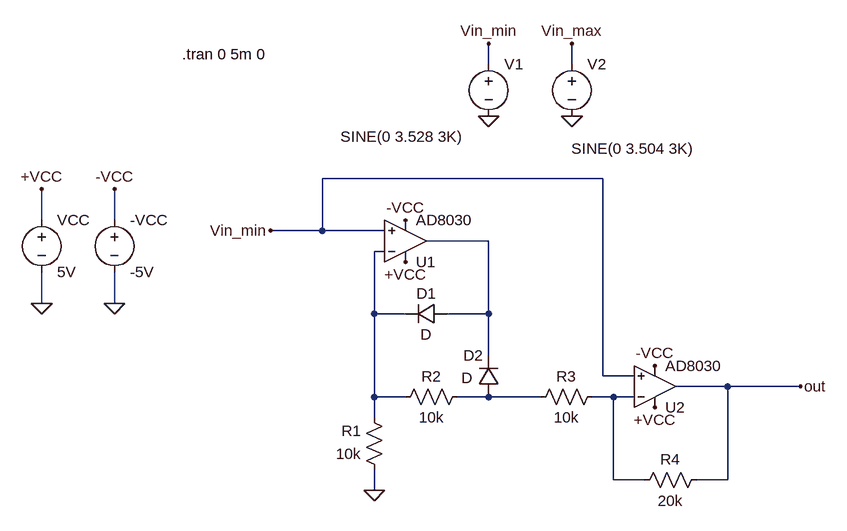
[diagram p0: schematic Trans.asc]
Trans.asc, the LTspice schematic file:
Version 4.1
SHEET 1 880 680
WIRE 144 -304 144 -336
WIRE 272 -304 272 -336
WIRE 320 -128 -112 -128
WIRE -544 -64 -544 -112
WIRE -432 -64 -432 -112
WIRE -112 -48 -112 -128
WIRE -112 -48 -192 -48
WIRE -16 -48 -112 -48
WIRE 144 -32 48 -32
WIRE -16 -16 -32 -16
WIRE -544 64 -544 16
WIRE -432 64 -432 16
WIRE -32 80 -32 -16
WIRE 16 80 -32 80
WIRE 144 80 144 -32
WIRE 144 80 80 80
WIRE 144 144 144 80
WIRE 320 176 320 -128
WIRE 368 176 320 176
WIRE 512 192 432 192
WIRE 624 192 512 192
WIRE -32 208 -32 80
WIRE 16 208 -32 208
WIRE 144 208 96 208
WIRE 224 208 144 208
WIRE 336 208 304 208
WIRE 368 208 336 208
WIRE -32 240 -32 208
WIRE 336 336 336 208
WIRE 384 336 336 336
WIRE 512 336 512 192
WIRE 512 336 464 336
WIRE -32 352 -32 320
FLAG -32 352 0
FLAG 624 192 out
FLAG -432 64 0
FLAG -544 64 0
FLAG -544 -112 +VCC
FLAG -432 -112 -VCC
FLAG 16 0 +VCC
FLAG 400 224 +VCC
FLAG 16 -64 -VCC
FLAG 400 160 -VCC
FLAG 272 -224 0
FLAG 144 -224 0
FLAG 144 -336 Vin_min
FLAG 272 -336 Vin_max
FLAG -192 -48 Vin_min
SYMBOL OpAmps\\AD8030 16 32 M180
SYMATTR InstName U1
SYMBOL OpAmps\\AD8030 400 256 M180
SYMATTR InstName U2
SYMBOL diode 80 64 R90
WINDOW 0 0 32 VBottom 2
WINDOW 3 32 32 VTop 2
SYMATTR InstName D1
SYMBOL diode 160 208 R180
WINDOW 0 24 64 Left 2
WINDOW 3 41 29 Left 2
SYMATTR InstName D2
SYMBOL res -16 336 R180
WINDOW 0 36 76 Left 2
WINDOW 3 36 40 Left 2
SYMATTR InstName R1
SYMATTR Value 10k
SYMBOL res 112 192 R90
WINDOW 0 0 56 VBottom 2
WINDOW 3 32 56 VTop 2
SYMATTR InstName R2
SYMATTR Value 10k
SYMBOL res 320 192 R90
WINDOW 0 0 56 VBottom 2
WINDOW 3 32 56 VTop 2
SYMATTR InstName R3
SYMATTR Value 10k
SYMBOL res 480 320 R90
WINDOW 0 0 56 VBottom 2
WINDOW 3 32 56 VTop 2
SYMATTR InstName R4
SYMATTR Value 20k
SYMBOL voltage -544 -80 R0
WINDOW 123 0 0 Left 0
WINDOW 39 0 0 Left 0
SYMATTR InstName VCC
SYMATTR Value 5V
SYMBOL voltage -432 -80 R0
WINDOW 123 0 0 Left 0
WINDOW 39 0 0 Left 0
SYMATTR InstName -VCC
SYMATTR Value -5V
SYMBOL voltage 144 -320 R0
WINDOW 3 -228 127 Left 2
WINDOW 123 0 0 Left 0
WINDOW 39 0 0 Left 0
SYMATTR Value SINE(0 3.528 3K)
SYMATTR InstName V1
SYMBOL voltage 272 -320 R0
WINDOW 3 -1 146 Left 2
WINDOW 123 0 0 Left 0
WINDOW 39 0 0 Left 0
SYMATTR Value SINE(0 3.504 3K)
SYMATTR InstName V2
TEXT -328 -320 Left 2 !.tran 0 5m 0

The netlist it stands for:
* Trans.asc
X§U1 Vin_min N002 +VCC -VCC N001 AD8040  ; AD8030, pins In+ In- V+ V- OUT
X§U2 Vin_min N004 +VCC -VCC out AD8040  ; AD8030, pins In+ In- V+ V- OUT
D1 N001 N002 D
D2 N003 N001 D
R1 0 N002 10k
R2 N003 N002 10k
R3 N004 N003 10k
R4 out N004 20k
VCC +VCC 0 5V
V§-VCC -VCC 0 -5V
V1 Vin_min 0 SINE(0 3.528 3K)
V2 Vin_max 0 SINE(0 3.504 3K)
.model D D
.lib standard.dio
.tran 0 5m 0
.lib ADI.lib
.backanno
.end